# Altium project GNNS,IMU.PrjPcb
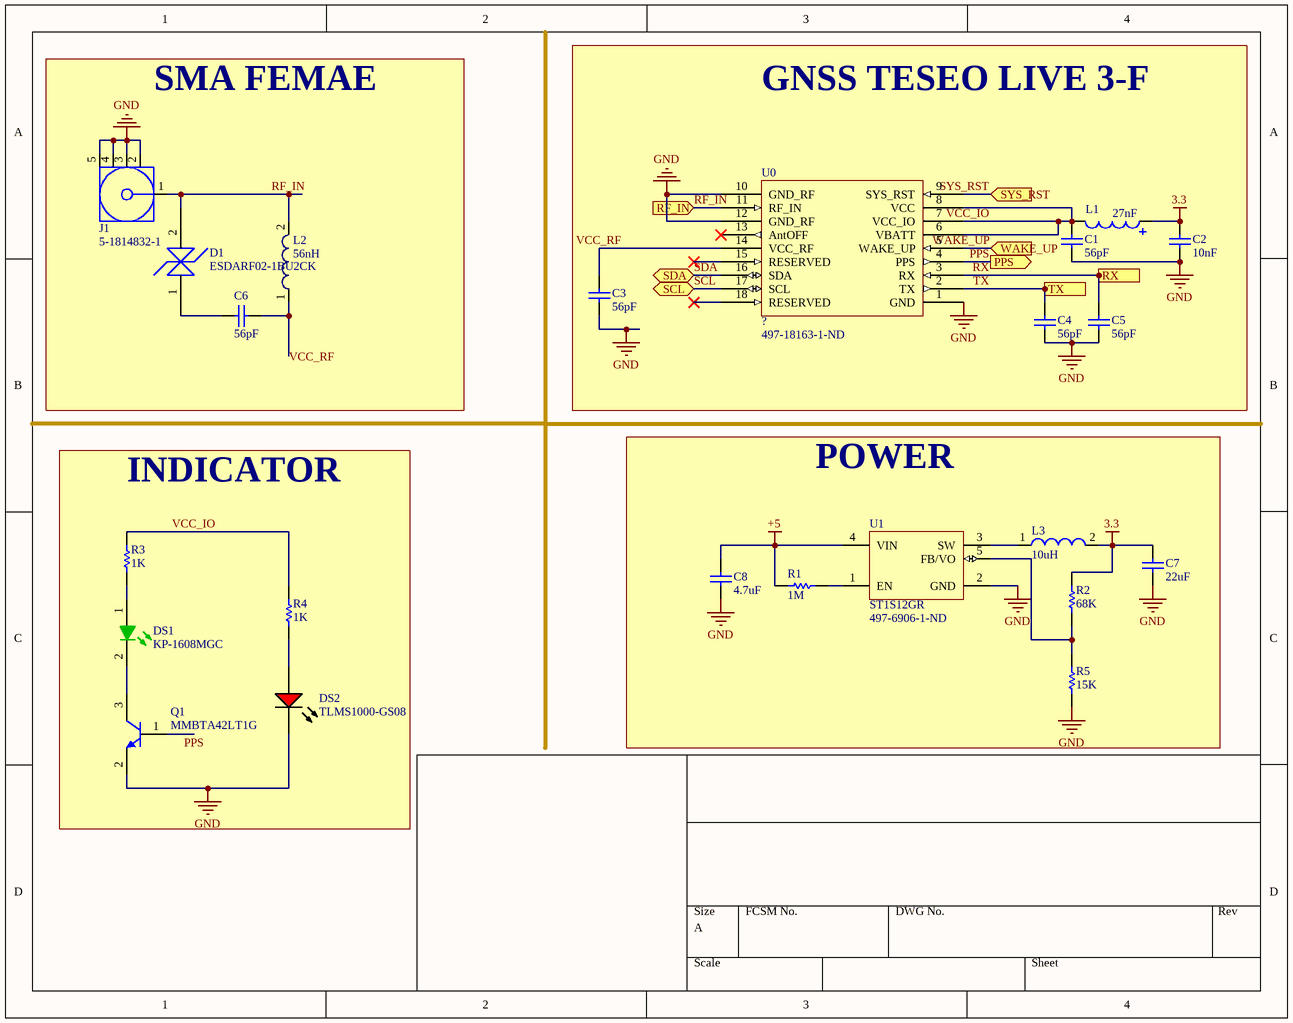
[diagram p0: Sheet1.SchDoc]
2 sheets, 29 parts. Net scope: flat (ports and power ports of the same name join across sheets).
Board file: PCB1.PcbDoc
Sheets:
  Sheet1.SchDoc
  Sheet2.SchDoc

## Sheet Sheet1.SchDoc: GNSS
size A

### Parts
C1  56pF  [CAPC0603X33X15LL03T05]
C2  10nF  [CAPC1005X60X30LL05T10]
C3  56pF  [CAPC0603X33X15LL03T05]
C4  56pF  [CAPC0603X33X15LL03T05]
C5  56pF  [CAPC0603X33X15LL03T05]
C6  56pF  [CAPC0603X33X15LL03T05]
C7  22uF  [CAPC2013X145X50ML20T25]
C8  4.7uF  [CAPC1608X90X35LL10T15]
D1  ESDARF02-1BU2CK  [ESDARFO2-1BU2CK]
DS1  KP-1608MGC  [KING-0603LED_GREEN_V]
DS2  TLMS1000-GS08  [VISH-TLMS1000_V]
J1  5-1814832-1  [TECO-5-1814832-1_V]
L1  27nF  [IND1005X55X25LL5T10]
L2  56nH  [WE-CAIR_4248]
L3  10uH  [WE-PD2-MS]
Q1  MMBTA42LT1G  [ONSC-SOT-23-3-318-08_V]
R1  1M  [RESC1005X40X25NL05T10]
R2  68K  [RESC1005X37X25LL05T10]
R3  1K  [RESC1608X55X30LL15T15]
R4  1K  [RESC1608X55X30LL15T15]
R5  15K  [RESC1005X40X25ML05T10]
U0  ?  Supplier Part Number 1: 497-18163-1-ND  [TESEO LIV 3F]
U1  ST1S12GR  Supplier Part Number 1: 497-6906-1-ND  [TSOT23-5L_N]

### Blocks framed on the sheet
SMA FEMAE: C6 D1 J1 L2
GNSS TESEO LIVE 3-F: C1-C5 L1 U0
POWER: C7 C8 L3 R1 R2 R5 U1
INDICATOR: DS1 DS2 Q1 R3 R4

### Ports
PPS (out), RF_IN (in), RX (in), SCL (bidir), SDA (bidir), SYS_RST (in), TX (out), WAKE_UP (in)

### Nets
3.3: C2.2 C7.2 L1.1 L3.2 R2.2
+5: C8.2 R1.2 U1.4(VIN)
GND: C1.1 C2.1 C3.2 C4.2 C5.2 C7.1 C8.1 DS2.2(K) J1.2 J1.3 J1.4 J1.5 Q1.2(E) R5.1 U0.1(GND) U0.10(GND_RF) U0.12(GND_RF) U1.2(GND)
PPS: Q1.1(B) U0.4(PPS) ; port PPS
RF_IN: D1.2 J1.1 L2.2 U0.11(RF_IN) ; port RF_IN
RX: C5.1 U0.3(RX) ; port RX
SCL: U0.17(SCL) ; port SCL
SDA: U0.16(SDA) ; port SDA
SYS_RST: U0.9(SYS_RST) ; port SYS_RST
TX: C4.1 U0.2(TX) ; port TX
VCC_IO: C1.2 L1.2 R3.2 R4.2 U0.6(VBATT) U0.7(VCC_IO) U0.8(VCC)
VCC_RF: C3.1 C6.2 L2.1 U0.14(VCC_RF)
WAKE_UP: U0.5(WAKE_UP) ; port WAKE_UP
NetC6_1: C6.1 D1.1
NetDS1_1: DS1.1(A) R3.1
NetDS1_2: DS1.2(K) Q1.3(C)
NetDS2_1: DS2.1(A) R4.1
NetL3_1: L3.1 U1.3(SW)
NetR1_1: R1.1 U1.1(EN)
NetR2_1: R2.1 R5.2 U1.5(FB/VO)

Not connected (* = marked no-connect by the designer): U0 13(AntOFF)* 15(RESERVED)* 18(RESERVED)*

### Library data of the parts
C1 C3-C6 = CAP SMD 56pF 0201: Multilayer Ceramic Capacitors MLCC - SMD/SMT 0201 56pF 50volts C0G +/-2%; Part Number: GRM0335C1H560GA01D; Manufacturer: Murata; Voltage Rating: 50V; Tolerance: 2%; Supplier 1: Digi-Key; Manufacturer 1: Murata; Manufacturer Part Number 1: GRM0335C1H560GA01D; Stock 1: 103814; Pricing 1: 1=0.10000, 10=0.02000, 100=0.00900, 500=0.00644, 1000=0.00506, 2500=0.00460, 5000=0.00423 (USD); RoHS: Yes; Mount: Surface Mount; Case/Package: 0201; Case Code (Imperial): 0201; Case Code (Metric): 0603; Min Operating Temperature: -55°C; Max Operating Temperature: 125°C; Capacitance: 56pF; Voltage Rating (DC): 50V; Packaging: Tape and Reel; Package Quantity: 15000; Dielectric: C0G; Termination: SMD/SMT; Length: 0.024inch; Height: 0.3mm; Width: 0.012inch; Thickness: 0.013inch; ComponentLink1URL: https://datasheet.ciiva.com/29538/partnumbering-e-01-29538479.pdf?src-supplier=Digi-Key; ComponentLink1Description: https://datasheet.ciiva.com/29538/partnumbering-e-01-29538479.pdf?src-supplier=Digi-Key; Supplier Part Number 1: 490-13329-1-ND
C2 = CMP-2008-02243-1: Manufacturer: Kemet; Part Number: C0402C103J4RAC7867
C7 = CAP SMD 22uF 0805: Capacitor, Ceramic, SMD, / MLCC, Temperature Stable, / Class II, 22 uF, +/-20%, 6.3 V, / X5R, 0805; Part Number: C0805C226M9PAC7800; Manufacturer: Kemet; Manufacturer Part Number 1: C0805C226M9PACTU; Tolerance: 20%; Voltage Rating: 6.3V; Dissipation Factor: 5%; Supplier 1: Digi-Key; Manufacturer 1: KEMET; Stock 1: 115947; Pricing 1: 1=0.24000, 10=0.16600, 100=0.08410, 500=0.05758, 1000=0.05093 (USD); RoHS: Yes; Mount: Surface Mount; Case/Package: 0805; Case Code (Imperial): 0805; Case Code (Metric): 2012; Dielectric Material: Ceramic; Min Operating Temperature: -55°C; Max Operating Temperature: 85°C; Capacitance: 22uF; Package Quantity: 2500; Voltage Rating (DC): 6.3V; Packaging: Tape and Reel; Dielectric: X5R; Termination: SMD/SMT; Voltage: 6.3V; Length: 2mm; Height: 1.25mm; Width: 1.2mm; Depth: 1.25mm; Radiation Hardening: No; Lead Free: Lead Free; ComponentLink1URL: https://datasheet.ciiva.com/18193/getdatasheetpartid-344134-18193702.pdf?src-supplier=Verical; ComponentLink1Description: https://datasheet.ciiva.com/18193/getdatasheetpartid-344134-18193702.pdf?src-supplier=Verical; ComponentLink2URL: https://datasheet.ciiva.com/7842/40889-7842585.pdf?src-supplier=Element14; ComponentLink2Description: https://datasheet.ciiva.com/7842/40889-7842585.pdf?src-supplier=Element14; Supplier Part Number 1: 399-4696-1-ND
C8 = CMP-2006-02523-1: 0603 4.7 uF 25 V ±10 % Tolerance X5R SMT Multilayer Ceramic Capacitor Ceramic Capacitors 0.09620; Part Number: GRM188R61E475KE11D; Manufacturer: Murata
D1 = ESDARF02-1BU2CK: TVS DIODE 3.6V 12V 0201; Manufacturer 1: STMicroelectronics; Number of Bidirectional Channels: 1; Min Breakdown Voltage: 5V; Peak Pulse Power: 20W; Power Line Protection: No; Polarity: Bidirectional; Peak Pulse Current: 1A; Supplier 1: Digi-Key; Manufacturer Part Number 1: ESDARF02-1BU2CK; Stock 1: 134; Pricing 1: 1=0.33000, 10=0.24700, 100=0.11740, 500=0.09580, 1000=0.07107, 2500=0.06242, 5000=0.05717 (USD); RoHS: Yes; Mount: Surface Mount; Case/Package: 0201; Number of Pins: 2; Min Operating Temperature: -40°C; Max Operating Temperature: 150°C; Packaging: Cut Tape; Reverse Standoff Voltage: 3.6V; Clamping Voltage: 12V; Composition: Zener; REACH SVHC: No SVHC; ComponentLink1URL: http://www.farnell.com/datasheets/2025703.pdf?src-supplier=Farnell; ComponentLink1Description: http://www.farnell.com/datasheets/2025703.pdf?src-supplier=Farnell; ComponentLink2URL: http://www.mouser.com/ds/2/389/esdarf02-1bu2ck-954652.pdf?src-supplier=Mouser; ComponentLink2Description: http://www.mouser.com/ds/2/389/esdarf02-1bu2ck-954652.pdf?src-supplier=Mouser; ComponentLink3URL: http://www.st.com/content/ccc/resource/technical/document/datasheet/6d/11/74/c3/f2/d5/43/1b/DM00090692.pdf/files/DM00090692.pdf/jcr:content/translations/en.DM00090692.pdf?src-supplier=Digi-Key; ComponentLink3Description: http://www.st.com/content/ccc/resource/technical/document/datasheet/6d/11/74/c3/f2/d5/43/1b/DM00090692.pdf/files/DM00090692.pdf/jcr:content/translations/en.DM00090692.pdf?src-supplier=Digi-Key; ComponentLink4URL: http://www.farnell.com/datasheets/2025703.pdf?src-supplier=Element14; ComponentLink4Description: http://www.farnell.com/datasheets/2025703.pdf?src-supplier=Element14; Supplier Part Number 1: 497-16252-1-ND
DS1 = CMP-0404-00001-1: LED, SMT, 0603(1608), 1.1mm thickness, Green; Manufacturer: Kingbright; Reverse Voltage: 5 V; Power Dissipation: 75 mW; Forward Current: 30 mA; Packing Type: 2000 pcs / reel; Mounting Technology: Surface Mount; Storage Temperature: -40 to +85 degC; ComponentLink1URL: http://www.kingbright.com/; PackageDescription: 2-Pin SMT LED, 1.6 x 0.8 mm Pitch; PartNumber: KP-1608MGC; PackageReference: 0603LED_GREEN; ComponentLink1Description: Manufacturer URL
DS2 = CMP-2000-07254-1: Low Current LED, 40 mW, 1.8 V, -40 to 100 degC, 2-Pin SMD (0603), RoHS, Tape and Reel; Manufacturer: Vishay; Lens Shape: Rectangular; Automotive Qualification Standard: AEC-Q100; Wavelength Typ: 636nm; SVHC: ToBeAdvised; LED Colour: Red; Bulb Size: 1.6mmx0.8mm; Forward Voltage: 1.8V; Luminous Intensity: 4mcd; Forward Current If: 2mA; Viewing Angle: 80°; Datasheet Version: Rev. 1.7, 02/2011; Datasheet URL: https://datasheet.ciiva.com/5798/1698881-5798337.pdf; LED Mounting: SMD; Packaging: CutTape; Package Reference: TLMS1000; Manufacturer URL: http://www.vishay.com/; Mounting Technology: SurfaceMount; Product Range: -; Package Description: 2-Pin Surface Mount Device, Body 1.6 x 0.8 mm; MSL: MSL2-1year
J1 = CMP-2000-05415-1: SMA Connector, Pitch 5.08 mm, 1 Position, Height 9.5 mm, Tail Length 4 mm, -65 to 165 degC, RoHS, Bulk; Manufacturer: TE Connectivity; Connector Mounting: PCBMount; Connector Body Style: StraightJack; Impedance: 50ohm; Coaxial Termination: Solder; SVHC: NoSVHC(15-Jun-2015); Frequency Max: 3GHz; Product Range: ZDCSeries; Connector Type: SMACoaxial; Datasheet Version: Rev. B1, 03/2011; Package Reference: 5-1814832-1; Package Description: SMA Connector, Pitch 5.08 mm, 1 Position, Height 9.5 mm, Tail Length 4 mm; Contact Plating: GoldPlatedContacts; Coaxial Cable Types: -; Contact Material: BerylliumCopper; Manufacturer URL: http://www.te.com/; Datasheet URL: http://www.onlinecomponents.com/productFiles/mf-AMP/eng_cd_1814832_a.pdf
L1 = IND SMD 27nH 0.3A: Chip Inductor, 27 nH, 5%, 300 mA, -55 to 125 degC, 2-Pin SMD (0402), RoHS, Tape and Reel; Manufacturer: Murata; Shielding: Unshielded; Other Names: 490-2628-2; Product Training Modules: InductorProducts; Catalog Drawings: LQG15HSSeriesTopLQG15HSSeriesEnd; Frequency - Self Resonant: 1.7GHz; Type: Multilayer; DC Resistance (DCR): 460mOhmMax; Frequency - Test: 100MHz; Current Rating: 300mA; Inductance: 27nH; Online Catalog: LQG15HxSeries; Material - Core: Air; Q @ Freq: 8@100MHz; Tolerance: ±5%; Series: LQG15HS; Package / Case: 0402(1005Metric); Manufacturer URL: http://www.murata.com/; Datasheet Version: 09/2010; Category: Inductors,Coils,Chokes; Package Reference: 0402; Operating Temperature: -55°C~125°C; Packaging: Tape&Reel(TR); Family: FixedInductors; Datasheet URL: http://download.siliconexpert.com/pdfs/2010/9/19/0/28/16/422/mrt_/manual/l0075s0083lqg15hs.pdf; Standard Package: 10,000; Size / Dimension: 0.039"Lx0.020"W(1.00mmx0.50mm); Mounting Type: SurfaceMount; Package Description: 2-Pin Surface Mount Device, Body 1 x 0.5 mm; Mounting Technology: SurfaceMount; Height - Seated (Max): 0.022"(0.55mm); Supplier 1: Digi-Key; Supplier Part Number 1: 490-2628-1-ND
L2 = CMP-1497-00011-1: WE-CAIR Air Coil, L=56 nH; Manufacturer: Wuerth Elektronik; PartNumber: 744912156; ComponentLink2Description: Datasheet; PackageReference: WE-CAIR_4248; Inductance: 56 nH; ComponentLink1URL: http://www.we-online.com; ComponentLink1Description: Manufacturer URL; ComponentLink2URL: http://katalog.we-online.de/kataloge/eisos/media/pdf/744912156.pdf
L3 = CMP-0227-00513-1: SMD Power Inductor WE-PD2, L = 10.0 µH; Inductance: 10.0 ÂµH; DatasheetVersion: ver 2, May-2009; PackageReference: WE-PD2-MS; PackageVersion: 2009; PackageDescription: SMD Inductor, 2-Leads, Body 5.8 x 5.2 mm; ComponentLink2Description: Datasheet; ComponentLink1Description: Manufacturer Link; ComponentLink1URL: http://www.we-online.com; ComponentLink2URL: http://www.we-online.de/katalog/media/pdf/7447745100.pdf
Q1 = CMP-1048-00662-1: High Voltage Transistor, NPN Silicon, 3-Pin SOT-23, Pb-Free, Tape and Reel; Manufacturer: On Semiconductor; fT Min (MHz): 50; IC Continuous (A): 0.5; ComponentLink1URL: http://www.onsemi.com/; ComponentLink3URL: http://www.onsemi.cn/pub_link/Collateral/318-08.PDF; RoHS: TRUE; ComponentLink2Description: Datasheet; PartNumber: MMBTA42LT1G; Polarity: NPN; DatasheetVersion: Rev. 12; PackageReference: SOT-23-3-318-08; PackageDescription: 3-Pin Small Outline Transistor, Body 2.92 x 1.3 mm, Pitch 0.95 mm; ComponentLink3Description: Package Specification; ComponentLink1Description: Manufacturer URL; Packing: Tape and Reel; PackageVersion: Rev. AP, 11/2009; Mounting Technology: Surface Mount; ComponentLink2URL: http://www.onsemi.cn/pub_link/Collateral/MMBTA42LT1-D.PDF
R1 = RES SMD 1M 0402: RC0402JR-071ML Checked RES SMD 1M OHM 5% 1/16W 0402 Chip SMD Resistors 0.00590; Manufacturer: Yageo / Phycomp; Part Number: RC0402JR-071ML; Supplier 1: Digi-Key; Supplier Part Number 1: 311-1.0MJRCT-ND
R2 = RES SMD 68K 0402: Surface mount chip resistor 68K; / 1%; 1/16 W; Part Number: AC0402FR-0768KL; Manufacturer: Yageo; Power Rating: 62.5mW; Resistance: 68kR; Voltage Rating: 50V; Max Power Dissipation: 63mW; Temperature Coefficient: 100ppm/°C; Supplier 1: Digi-Key; Manufacturer 1: Yageo; Manufacturer Part Number 1: AC0402FR-0768KL; Stock 1: 97686; Pricing 1: 1=0.10000, 10=0.02100, 100=0.00870, 1000=0.00390, 2500=0.00338, 5000=0.00279 (USD); RoHS: Yes; Case/Package: 0402; Case Code (Imperial): 0402; Case Code (Metric): 1005; Min Operating Temperature: -55°C; Max Operating Temperature: 155°C; Tolerance: 1%; Packaging: Tape and Reel; Composition: Thick Film; Number of Terminations: 2; Termination: SMD/SMT; Features: Moisture Resistant,Automotive AEC-Q200; Length: 0.039inch; Height: 0.015inch; Width: 0.02inch; Lead Free: Lead Free; ComponentLink1URL: http://www.mouser.com/ds/2/447/yageodocoutput-1111992.pdf?src-supplier=Mouser; ComponentLink1Description: http://www.mouser.com/ds/2/447/yageodocoutput-1111992.pdf?src-supplier=Mouser; ComponentLink2URL: http://www.yageo.com/NewPortal/yageodocoutput?fileName=/pdf/R-Chip/PYu-AC_51_RoHS_L_6.pdf&src-supplier=Digi-Key; ComponentLink2Description: http://www.yageo.com/NewPortal/yageodocoutput?fileName=/pdf/R-Chip/PYu-AC_51_RoHS_L_6.pdf&src-supplier=Digi-Key; ComponentLink3URL: http://www.yageo.com/documents/recent/PYu-AC_51_RoHS_L_2_revised.pdf?src-supplier=Future+Electronics; ComponentLink3Description: http://www.yageo.com/documents/recent/PYu-AC_51_RoHS_L_2_revised.pdf?src-supplier=Future+Electronics; Supplier Part Number 1: YAG3506CT-ND
R3 R4 = CMP-2000-00180-1: Part Number: ERJ-3EKF1001V; Manufacturer: Panasonic
R5 = RES SMD 15K 0402: Surface mount chip resistor / 15 K; 1%; 1/16 W; Manufacturer: Yageo / Phycomp; Part Number: RC0402FR-1315KL; Manufacturer 1: Yageo; Resistance: 15kR; Temperature Coefficient: 100ppm/°C; Power Rating: 62.5mW; Voltage Rating: 50V; Supplier 1: Mouser; Manufacturer Part Number 1: RC0402FR-1315KL; Stock 1: 90985; Pricing 1: 1=0.10000, 10=0.01200, 100=0.00400, 1000=0.00300, 2500=0.00300, 10000=0.00300 (USD); RoHS: Yes; Case/Package: 0402; Contact Plating: Tin,Matte; Case Code (Imperial): 0402; Case Code (Metric): 1005; Min Operating Temperature: -55°C; Max Operating Temperature: 155°C; Tolerance: 1%; Composition: Thick Film; Packaging: Tape and Reel; Termination: SMD/SMT; Military Standard: Not; Length: 1mm; Height: 0.35mm; Width: 0.5mm; Depth: 0.5mm; Lead Free: Lead Free; ComponentLink1URL: https://datasheet.ciiva.com/16866/pyu-rc0402-51-rohs-l-6-16866521.pdf?src-supplier=Avnet+Europe; ComponentLink1Description: https://datasheet.ciiva.com/16866/pyu-rc0402-51-rohs-l-6-16866521.pdf?src-supplier=Avnet+Europe; ComponentLink2URL: https://datasheet.ciiva.com/28404/pyu-rc0402-51-rohs-l-6-28404185.pdf?src-supplier=Avnet+Europe; ComponentLink2Description: https://datasheet.ciiva.com/28404/pyu-rc0402-51-rohs-l-6-28404185.pdf?src-supplier=Avnet+Europe; ComponentLink3URL: https://datasheet.ciiva.com/17423/pyu-rc0402-51-rohs-l-6-r-17423757.pdf?src-supplier=Future+Electronics; ComponentLink3Description: https://datasheet.ciiva.com/17423/pyu-rc0402-51-rohs-l-6-r-17423757.pdf?src-supplier=Future+Electronics; Supplier Part Number 1: 603-RC0402FR-1315KL
U0 = TESEO-LIV3F: GNSS MODULE; Manufacturer 1: STMicroelectronics; Supplier 1: Digi-Key; Manufacturer Part Number 1: TESEO-LIV3F; Stock 1: 1024; Pricing 1: 1=14.93000, 10=13.50600, 100=11.37360, 500=9.95190 (USD); RoHS: No; ComponentLink1URL: https://media.digikey.com/pdf/Data%20Sheets/ST%20Microelectronics%20PDFS/Intro_to_GNSS_Teseo_LIV3F_for_IoT_9-12-18.pdf?src-supplier=Digi-Key; ComponentLink1Description: https://media.digikey.com/pdf/Data%20Sheets/ST%20Microelectronics%20PDFS/Intro_to_GNSS_Teseo_LIV3F_for_IoT_9-12-18.pdf?src-supplier=Digi-Key; ComponentLink2URL: https://www.st.com/resource/en/datasheet/teseo-liv3f.pdf?src-supplier=Digi-Key; ComponentLink2Description: https://www.st.com/resource/en/datasheet/teseo-liv3f.pdf?src-supplier=Digi-Key
U1 = Syn Buck Converter: Synchronous rectification with inhibit, 0.7 A, 1.7 MHz adjustable, step-down switching regulator, 5-Pin TSOT, Tape and Reel; Manufacturer 1: STMicroelectronics; Output Voltage: 1.2V; Operating Supply Voltage: 5.5V; Number of Outputs: 1; Min Input Voltage: 2.5V; Output Current: 700mA; Switching Frequency: 1.7MHz; Efficiency: 90%; Synchronous Rectifier: Yes; Min Output Voltage: 600mV; Max Output Voltage: 5V; Supplier 1: Digi-Key; Manufacturer Part Number 1: ST1S12GR; Stock 1: 672; Pricing 1: 1=1.06000, 10=0.94500, 100=0.68870, 500=0.57660, 1000=0.44846 (USD); RoHS: Yes; Mount: Surface Mount; Case/Package: TSOT; Number of Pins: 5; Min Operating Temperature: -40°C; Max Operating Temperature: 125°C; Max Input Voltage: 5.5V; Packaging: Tape and Reel; Package Quantity: 1; Max Output Current: 700mA; Output Type: Adjustable; Radiation Hardening: No; Lead Free: Lead Free; REACH SVHC: No SVHC; ComponentLink1URL: https://datasheet.ciiva.com/16220/cd00181873-16220420.pdf?src-supplier=Future+Electronics; ComponentLink1Description: https://datasheet.ciiva.com/16220/cd00181873-16220420.pdf?src-supplier=Future+Electronics; ComponentLink2URL: https://datasheet.ciiva.com/15113/getdatasheetpartid-164460-15113322.pdf?src-supplier=Verical; ComponentLink2Description: https://datasheet.ciiva.com/15113/getdatasheetpartid-164460-15113322.pdf?src-supplier=Verical; ComponentLink3URL: https://datasheet.ciiva.com/17367/cd00181873-17367226.pdf?src-supplier=Avnet+Europe; ComponentLink3Description: https://datasheet.ciiva.com/17367/cd00181873-17367226.pdf?src-supplier=Avnet+Europe; ComponentLink4URL: https://datasheet.ciiva.com/2025/cd00181873-2025213.pdf?src-supplier=Digi-Key; ComponentLink4Description: https://datasheet.ciiva.com/2025/cd00181873-2025213.pdf?src-supplier=Digi-Key; ComponentLink5URL: https://datasheet.ciiva.com/2025/cd00181873-2025214.pdf?src-supplier=Digi-Key; ComponentLink5Description: https://datasheet.ciiva.com/2025/cd00181873-2025214.pdf?src-supplier=Digi-Key; ComponentLink6URL: https://datasheet.ciiva.com/2025/cd00181873-2025215.pdf?src-supplier=Digi-Key; ComponentLink6Description: https://datasheet.ciiva.com/2025/cd00181873-2025215.pdf?src-supplier=Digi-Key; ComponentLink7URL: https://datasheet.ciiva.com/41457/001185701-da-01-en-ic-reg-buck-sync-a-st1s12gr-sot-23-5-stm-41457541.pdf?src-supplier=Conrad; ComponentLink7Description: https://datasheet.ciiva.com/41457/001185701-da-01-en-ic-reg-buck-sync-a-st1s12gr-sot-23-5-stm-41457541.pdf?src-supplier=Conrad

## Sheet Sheet2.SchDoc
size A; CompanyName: RUDRA
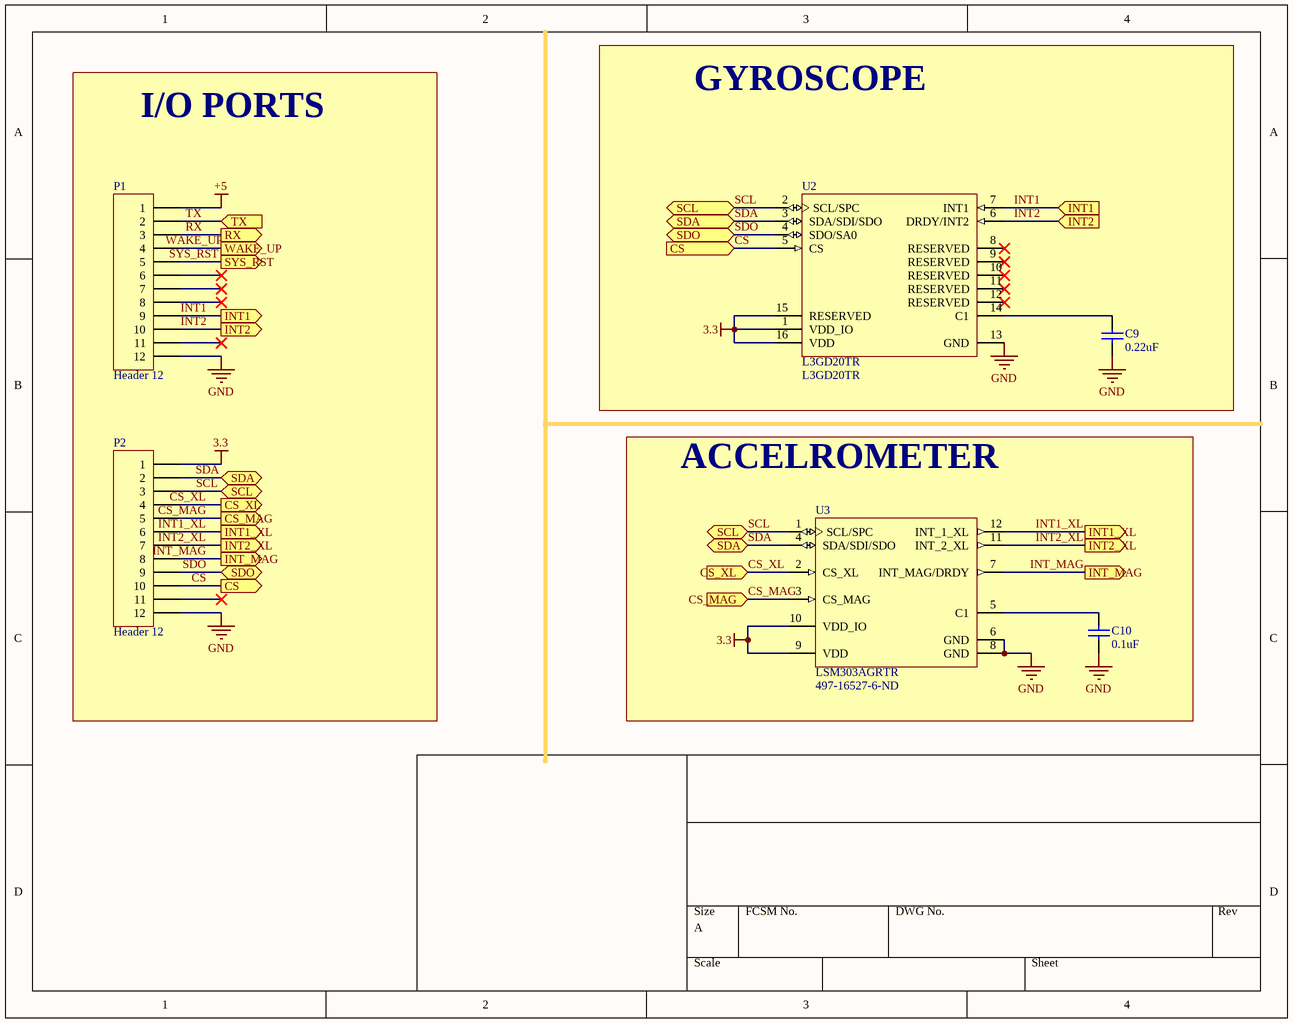
[diagram p1: Sheet2.SchDoc]

### Parts
C9  0.22uF  [CAPC2013X140X50ML20T25]
C10  0.1uF  [CAPC2013X135X45LL10T25]
P1  Header 12  [HDR1X12]
P2  Header 12  [HDR1X12]
U2  L3GD20TR  [STM-LGA16-4X4X1.1]
U3  LSM303AGRTR  Supplier Part Number 1: 497-16527-6-ND  [STM-LGA-12]

### Blocks framed on the sheet
I/O PORTS: P1 P2
GYROSCOPE: C9 U2
ACCELROMETER: C10 U3

### Ports
CS (in), CS (out), CS_MAG (in), CS_MAG (out), CS_XL (in), CS_XL (out), INT1 (in), INT1 (out), INT1_XL (out), INT2 (in), INT2 (out), INT2_XL (out), INT_MAG  (out), INT_MAG (out), RX (out), SCL (bidir), SDA (bidir), SDO (bidir), SYS_RST (out), TX (in), WAKE_UP (out)

### Nets
3.3: P2.1 U2.1(VDD_IO) U2.15(RESERVED) U2.16(VDD) U3.9(VDD) U3.10(VDD_IO)
+5: P1.1
GND: C9.1 C10.1 P1.12 P2.12 U2.13(GND) U3.6(GND) U3.8(GND)
CS: P2.10 U2.5(CS) ; port CS  [also labelled CS ]
CS_MAG: P2.5 U3.3(CS_MAG) ; port CS_MAG
CS_XL: P2.4 U3.2(CS_XL) ; port CS_XL
INT1: P1.9 U2.7(INT1) ; port INT1  [also labelled INT1 ]
INT1_XL: P2.6 U3.12(INT_1_XL) ; port INT1_XL
INT2: P1.10 U2.6(DRDY/INT2) ; port INT2  [also labelled INT2 ]
INT2_XL: P2.7 U3.11(INT_2_XL) ; port INT2_XL
INT_MAG: P2.8 U3.7(INT_MAG/DRDY) ; port INT_MAG , port INT_MAG
RX: P1.3 ; port RX
SCL: P2.3 U2.2(SCL/SPC) U3.1(SCL/SPC) ; port SCL
SDA: P2.2 U2.3(SDA/SDI/SDO) U3.4(SDA/SDI/SDO) ; port SDA
SDO: P2.9 U2.4(SDO/SA0) ; port SDO
SYS_RST: P1.5 ; port SYS_RST
TX: P1.2 ; port TX
WAKE_UP: P1.4 ; port WAKE_UP
NetC9_2: C9.2 U2.14(C1)
NetC10_2: C10.2 U3.5(C1)

Not connected (* = marked no-connect by the designer): P1 6* 7* 8* 11*; P2 11*; U2 8(RESERVED)* 9(RESERVED)* 10(RESERVED)* 11(RESERVED)* 12(RESERVED)*

### Library data of the parts
C9 = CAP SMD 0.22uF 0805: CAP CER 0.22UF 25V X7R 0805; Manufacturer: AVX Interconnect / Elco; Part Number: 08053C224JAT2A; Manufacturer 1: Kyocera AVX; Dielectric Material: Ceramic; Capacitance: 220nF; Tolerance: 5%; Supplier 1: Digi-Key; Manufacturer Part Number 1: 08053C224JAT2A; Stock 1: 18745; Pricing 1: 1=0.28000, 10=0.19000, 100=0.09610, 500=0.06578, 1000=0.05819 (USD); RoHS: Yes; Mount: Surface Mount,PCB; Case/Package: 0805; Number of Pins: 2; Case Code (Imperial): 0805; Case Code (Metric): 2012; Contact Plating: Tin,Matte; Min Operating Temperature: -55°C; Max Operating Temperature: 125°C; Packaging: Tape and Reel; Voltage Rating (DC): 25V; Dielectric: X7R; Voltage Rating: 25V; Package Quantity: 1; Termination: SMD/SMT; Voltage: 25V; Length: 2.01mm; Height: 1.4mm; Depth: 1.25mm; Width: 1.25mm; Thickness: 0.055inch; Radiation Hardening: No; REACH SVHC: No SVHC; Lead Free: Lead Free; ComponentLink1URL: https://datasheet.ciiva.com/5417/cx7r-218113-5417493.pdf?src-supplier=Mouser; ComponentLink1Description: https://datasheet.ciiva.com/5417/cx7r-218113-5417493.pdf?src-supplier=Mouser; ComponentLink2URL: https://datasheet.ciiva.com/16326/cx7r-16326599.pdf?src-supplier=Future+Electronics; ComponentLink2Description: https://datasheet.ciiva.com/16326/cx7r-16326599.pdf?src-supplier=Future+Electronics; ComponentLink3URL: https://datasheet.ciiva.com/162/cx7r-162344.pdf?src-supplier=Digi-Key; ComponentLink3Description: https://datasheet.ciiva.com/162/cx7r-162344.pdf?src-supplier=Digi-Key; ComponentLink4URL: https://datasheet.ciiva.com/162/cx7r-162345.pdf?src-supplier=Digi-Key; ComponentLink4Description: https://datasheet.ciiva.com/162/cx7r-162345.pdf?src-supplier=Digi-Key; ComponentLink5URL: https://datasheet.ciiva.com/162/cx7r-162346.pdf?src-supplier=Digi-Key; ComponentLink5Description: https://datasheet.ciiva.com/162/cx7r-162346.pdf?src-supplier=Digi-Key; ComponentLink6URL: https://datasheet.ciiva.com/17494/cx7r-17494874.pdf?src-supplier=Avnet+Europe; ComponentLink6Description: https://datasheet.ciiva.com/17494/cx7r-17494874.pdf?src-supplier=Avnet+Europe; ComponentLink7URL: https://datasheet.ciiva.com/14594/70001075-14594669.pdf?src-supplier=Allied+Electronics; ComponentLink7Description: https://datasheet.ciiva.com/14594/70001075-14594669.pdf?src-supplier=Allied+Electronics; ComponentLink8URL: https://datasheet.ciiva.com/7811/cx7r-7811999.pdf?src-supplier=Element14; ComponentLink8Description: https://datasheet.ciiva.com/7811/cx7r-7811999.pdf?src-supplier=Element14; Supplier Part Number 1: 478-3756-1-ND
C10 = CAP SMD 0.1uF 0805: Chip Capacitor, 0.1 uF, +/- 10%, 50 V, -55 to 125 degC, 0805 (2012 Metric), RoHS, Tape and Reel; Manufacturer: Murata; Manufacturer Part Number 1: GRM21BR71H104KA01L; Voltage: 50V; Capacitance: 100nF; Insulation Resistance: 10GR; Dielectric Material: Ceramic; Dielectric: X7R; Package Description: 2-Pin Surface Mount Device, Body 2 x 1.25 mm; Manufacturer URL: http://www.murata.com/; Case Code (Imperial): 0805; Datasheet URL: http://psearch.en.murata.com/capacitor/product/GRM21BR71H104KA01%23.pdf; Termination: SMD/SMT; Lead Free: LeadFree; Package Quantity: 1; Mount: SurfaceMount; REACH SVHC: Unknown; Thickness: 0.053inch; Height: 1.25mm; Case/Package: 0805; Voltage Rating: 50V; Width: 0.049inch; Case Code (Metric): 2012; Material: Ceramic; Min Operating Temperature: -55degC; RoHSCompliant: true; Datasheet Version: 42675.0; Voltage Rating (DC): 50V; Tolerance: 10%; Package Reference: 0805; Depth: 1.25mm; Length: 2mm; Max Operating Temperature: 125degC; Packaging: TapeandReel; Number of Pins: 2; Radiation Hardening: No; Supplier 1: Future Electronics; Manufacturer 1: Murata; Stock 1: 7476000; Pricing 1: 3000=0.01700 (USD); RoHS: Yes; ComponentLink1URL: https://datasheet.ciiva.com/11786/0900766b8003061f-11786305.pdf?src-supplier=RSComponents; ComponentLink1Description: https://datasheet.ciiva.com/11786/0900766b8003061f-11786305.pdf?src-supplier=RSComponents; ComponentLink2URL: https://datasheet.ciiva.com/20173/71-2024-20173169.pdf?src-supplier=Rapid+Electronics; ComponentLink2Description: https://datasheet.ciiva.com/20173/71-2024-20173169.pdf?src-supplier=Rapid+Electronics; ComponentLink3URL: https://datasheet.ciiva.com/29200/453120-da-01-en-vs-kondensator-0805-29200537.pdf?src-supplier=Conrad; ComponentLink3Description: https://datasheet.ciiva.com/29200/453120-da-01-en-vs-kondensator-0805-29200537.pdf?src-supplier=Conrad; ComponentLink4URL: https://datasheet.ciiva.com/132/partnumbering-e-01-132209.pdf?src-supplier=Digi-Key; ComponentLink4Description: https://datasheet.ciiva.com/132/partnumbering-e-01-132209.pdf?src-supplier=Digi-Key; ComponentLink5URL: https://datasheet.ciiva.com/132/partnumbering-e-01-132210.pdf?src-supplier=Digi-Key; ComponentLink5Description: https://datasheet.ciiva.com/132/partnumbering-e-01-132210.pdf?src-supplier=Digi-Key; ComponentLink6URL: https://datasheet.ciiva.com/132/partnumbering-e-01-132211.pdf?src-supplier=Digi-Key; ComponentLink6Description: https://datasheet.ciiva.com/132/partnumbering-e-01-132211.pdf?src-supplier=Digi-Key; ComponentLink7URL: https://datasheet.ciiva.com/7937/1794405-7937708.pdf?src-supplier=Element14; ComponentLink7Description: https://datasheet.ciiva.com/7937/1794405-7937708.pdf?src-supplier=Element14; ComponentLink8URL: https://datasheet.ciiva.com/7937/1794405-7937709.pdf?src-supplier=Element14; ComponentLink8Description: https://datasheet.ciiva.com/7937/1794405-7937709.pdf?src-supplier=Element14; ComponentLink9URL: https://datasheet.ciiva.com/28534/1769893-28534317.pdf?src-supplier=Element14; ComponentLink9Description: https://datasheet.ciiva.com/28534/1769893-28534317.pdf?src-supplier=Element14; ComponentLink10URL: https://datasheet.ciiva.com/7937/4360-7937710.pdf?src-supplier=Element14; ComponentLink10Description: https://datasheet.ciiva.com/7937/4360-7937710.pdf?src-supplier=Element14; Supplier Part Number 1: GRM21BR71H104KA01L-REEL
P1 P2 = Header 12: Header, 12-Pin; LatestRevisionDate: 17-Jul-2002; LatestRevisionNote: Re-released for DXP Platform.; Publisher: Altium Limited
U2 = GYROSCOPE: MEMS Motion Sensor: Three-Axis Digital Output Gyroscope, 2.4 to 3.6 V, -40 to 85 degC, 16-Pin LGA, RoHS, Tape and Reel; Manufacturer: STMicroelectronics; Supply Current: 6.1 mA; SoDr: +/- 2%; Supply Current In Sleep Mode: 2 mA; Full Scales: 250, 500, 2000 dps; Max Supply Voltage: 3.6V; Min Supply Voltage: 2.4V; Nominal Supply Current: 6.1mA; Output Type: SPI,I2C,Digital; Linearity: 0.2%; Interface: I2C,SPI; DatasheetVersion: Rev. 2; PartNumber: L3GD20TR; ComponentLink2URL: http://www.st.com/web/en/resource/technical/document/datasheet/DM00036465.pdf; RoHS: TRUE; Temperature Range: -40 to 85 degC; PackageReference: LGA16-4X4X1.1; PackageDescription: 16-Pin Land Grid Array Package, Body 4 x 4 mm, Pitch 0.65 mm; ComponentLink2Description: Datasheet; ComponentLink1Description: Manufacturer URL; Supply Voltage: 2.4 to 3.6 V; Packing: Tape and Reel; PackageVersion: Rev. 2; ComponentLink1URL: http://www.st.com/; Mounting Technology: Surface Mount; ComponentLink3URL: http://www.st.com/web/en/resource/technical/document/datasheet/DM00036465.pdf; ComponentLink3Description: Package Specification; Supplier 1: Avnet; Manufacturer 1: STMicroelectronics; Manufacturer Part Number 1: L3GD20TR; Stock 1: 0; Case/Package: LGA; Number of Pins: 16; Min Operating Temperature: -40°C; Max Operating Temperature: 85°C; Package Quantity: 3000; Packaging: Tape and Reel; Operating Supply Voltage: 3.6V; Operating Supply Current: 6.1mA; Length: 4mm; Height: 1mm; Width: 4mm; Lead Free: Lead Free; REACH SVHC: No SVHC; ComponentLink4URL: https://datasheet.ciiva.com/2815/dm00036465-2815728.pdf?src-supplier=Digi-Key; ComponentLink4Description: https://datasheet.ciiva.com/2815/dm00036465-2815728.pdf?src-supplier=Digi-Key; ComponentLink5URL: https://datasheet.ciiva.com/2815/dm00036465-2815729.pdf?src-supplier=Digi-Key; ComponentLink5Description: https://datasheet.ciiva.com/2815/dm00036465-2815729.pdf?src-supplier=Digi-Key; ComponentLink6URL: https://datasheet.ciiva.com/12092/dm00036465-12092269.pdf?src-supplier=Mouser; ComponentLink6Description: https://datasheet.ciiva.com/12092/dm00036465-12092269.pdf?src-supplier=Mouser; ComponentLink7URL: https://datasheet.ciiva.com/2815/dm00036465-2815727.pdf?src-supplier=Digi-Key; ComponentLink7Description: https://datasheet.ciiva.com/2815/dm00036465-2815727.pdf?src-supplier=Digi-Key; Supplier Part Number 1: L3GD20TR
U3 = E-COMPASS: Ultra-Compact High-Performance Ecompass Module: Ultra-Low-Power 3D Accelerometer and 3D Magnetometer, 1.71 to 3.6 V, -40 to 85 degC, 12-Pin LGA, RoHS, Tape and Reel; Manufacturer: STMicroelectronics; Min Supply Voltage: 1.71V; Max Supply Voltage: 3.6V; Sensor Type: Accelerometer,Magnetometer,3 Axis; Output Type: SPI,I2C; Manufacturer URL: http://www.st.com/; Package Description: 12-Pin Land Grid Array Package, Body 2 x 2 mm, Pitch 0.5 mm; Mounting Technology: SurfaceMount; Packaging: CutTape; Datasheet URL: http://www.st.com/content/ccc/resource/technical/document/datasheet/74/c4/19/54/62/c5/46/13/DM00177685.pdf/files/DM00177685.pdf/jcr:content/translations/en.DM00177685.pdf; RoHSCompliant: true; Number of Pins: 12; Package Reference: LGA-12; Min Operating Temperature: -40degC; REACH SVHC: NoSVHC; Case\/Package: LGA; Max Operating Temperature: 85degC; Datasheet Version: Rev. 9, 09/2016; Supplier 1: Digi-Key; Manufacturer 1: STMicroelectronics; Manufacturer Part Number 1: LSM303AGRTR; Stock 1: 7477; Pricing 1: 1=2.92000, 10=2.61800, 25=2.47520, 100=2.14500, 500=1.82600, 1000=1.54000 (USD); RoHS: Yes; Case/Package: LGA; ComponentLink1URL: https://www.mouser.com/ds/2/389/lsm303agr-954987.pdf?src-supplier=Mouser; ComponentLink1Description: https://www.mouser.com/ds/2/389/lsm303agr-954987.pdf?src-supplier=Mouser; ComponentLink2URL: http://www.farnell.com/datasheets/2151221.pdf?src-supplier=Farnell; ComponentLink2Description: http://www.farnell.com/datasheets/2151221.pdf?src-supplier=Farnell; ComponentLink3URL: http://www.farnell.com/datasheets/2151221.pdf?src-supplier=Element14; ComponentLink3Description: http://www.farnell.com/datasheets/2151221.pdf?src-supplier=Element14; ComponentLink4URL: http://www.st.com/content/ccc/resource/technical/document/datasheet/74/c4/19/54/62/c5/46/13/DM00177685.pdf/files/DM00177685.pdf/jcr:content/translations/en.DM00177685.pdf?src-supplier=Digi-Key; ComponentLink4Description: http://www.st.com/content/ccc/resource/technical/document/datasheet/74/c4/19/54/62/c5/46/13/DM00177685.pdf/files/DM00177685.pdf/jcr:content/translations/en.DM00177685.pdf?src-supplier=Digi-Key

## Nets that join several sheets
3.3: Sheet1 (5 pins), Sheet2 (6 pins)
+5: Sheet1 (C8.2 R1.2 U1.4), Sheet2 (P1.1)
GND: Sheet1 (18 pins), Sheet2 (7 pins)
RX: Sheet1 (C5.1 U0.3), Sheet2 (P1.3)
SCL: Sheet1 (U0.17), Sheet2 (P2.3 U2.2 U3.1)
SDA: Sheet1 (U0.16), Sheet2 (P2.2 U2.3 U3.4)
SYS_RST: Sheet1 (U0.9), Sheet2 (P1.5)
TX: Sheet1 (C4.1 U0.2), Sheet2 (P1.2)
WAKE_UP: Sheet1 (U0.5), Sheet2 (P1.4)